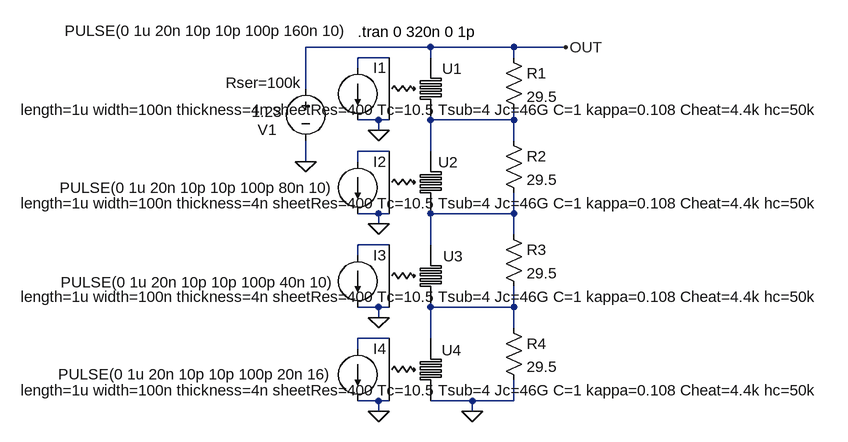
[diagram p0: schematic 4-element-pnr-test.asc]
4-element-pnr-test.asc, the LTspice schematic file:
Version 4
SHEET 1 880 680
WIRE 208 32 16 32
WIRE 336 32 208 32
WIRE 416 32 336 32
WIRE 144 48 96 48
WIRE 208 48 208 32
WIRE 336 48 336 32
WIRE 96 64 96 48
WIRE 16 96 16 32
WIRE 128 144 96 144
WIRE 144 144 128 144
WIRE 336 144 336 128
WIRE 336 144 208 144
WIRE 128 160 128 144
WIRE 336 176 336 144
WIRE 144 192 96 192
WIRE 208 192 208 144
WIRE 16 208 16 176
WIRE 96 208 96 192
WIRE 128 288 96 288
WIRE 144 288 128 288
WIRE 336 288 336 256
WIRE 336 288 208 288
WIRE 128 304 128 288
WIRE 336 320 336 288
WIRE 144 336 96 336
WIRE 208 336 208 288
WIRE 96 352 96 336
WIRE 128 432 96 432
WIRE 144 432 128 432
WIRE 336 432 336 400
WIRE 336 432 208 432
WIRE 128 448 128 432
WIRE 336 464 336 432
WIRE 144 480 96 480
WIRE 208 480 208 432
WIRE 96 496 96 480
WIRE 128 576 96 576
WIRE 144 576 128 576
WIRE 272 576 208 576
WIRE 336 576 336 544
WIRE 336 576 272 576
WIRE 128 592 128 576
WIRE 272 592 272 576
FLAG 128 160 0
FLAG 16 208 0
FLAG 128 304 0
FLAG 128 448 0
FLAG 128 592 0
FLAG 272 592 0
FLAG 416 32 OUT
SYMBOL snspdWithPhotonPort 208 96 R0
WINDOW 0 18 -31 Left 2
SYMATTR InstName U1
SYMATTR Value Lind=100n Isw=12.5u Tsub=1.18
SYMBOL res 320 32 R0
SYMATTR InstName R1
SYMATTR Value 29.5
SYMBOL current 96 64 R0
WINDOW 3 -451 -57 Left 2
WINDOW 123 0 0 Left 2
WINDOW 39 0 0 Left 2
SYMATTR Value PULSE(0 1u 20n 10p 10p 100p 160n 10)
SYMATTR InstName I1
SYMBOL snspdWithPhotonPort 208 240 R0
WINDOW 0 12 -31 Left 2
SYMATTR InstName U2
SYMATTR Value Lind=100n Isw=12.5u Tsub=1.18
SYMBOL res 320 160 R0
SYMATTR InstName R2
SYMATTR Value 29.5
SYMBOL current 96 208 R0
WINDOW 3 -459 40 Left 2
WINDOW 123 0 0 Left 2
WINDOW 39 0 0 Left 2
SYMATTR Value PULSE(0 1u 20n 10p 10p 100p 80n 10)
SYMATTR InstName I2
SYMBOL voltage 16 80 R0
WINDOW 0 -74 79 Left 2
WINDOW 3 -83 51 Left 2
WINDOW 123 0 0 Left 2
WINDOW 39 -123 7 Left 2
SYMATTR InstName V1
SYMATTR Value 1.23
SYMATTR SpiceLine Rser=100k
SYMBOL snspdWithPhotonPort 208 384 R0
WINDOW 0 19 -30 Left 2
SYMATTR InstName U3
SYMATTR Value Lind=100n Isw=12.5u Tsub=1.18
SYMBOL res 320 304 R0
SYMATTR InstName R3
SYMATTR Value 29.5
SYMBOL current 96 352 R0
WINDOW 3 -457 42 Left 2
WINDOW 123 0 0 Left 2
WINDOW 39 0 0 Left 2
SYMATTR Value PULSE(0 1u 20n 10p 10p 100p 40n 10)
SYMATTR InstName I3
SYMBOL snspdWithPhotonPort 208 528 R0
WINDOW 0 17 -30 Left 2
SYMATTR InstName U4
SYMATTR Value Lind=100n Isw=12.5u Tsub=1.18
SYMBOL res 320 448 R0
SYMATTR InstName R4
SYMATTR Value 29.5
SYMBOL current 96 496 R0
WINDOW 3 -461 39 Left 2
WINDOW 123 0 0 Left 2
WINDOW 39 0 0 Left 2
SYMATTR Value PULSE(0 1u 20n 10p 10p 100p 20n 16)
SYMATTR InstName I4
TEXT 96 8 Left 2 !.tran 0 320n 0 1p

The netlist it stands for:
* 4-element-pnr-test.asc
XU1 N001 0 OUT N002 nanowireDynamic Lind=100n Isw=12.5u Tsub=1.18 length=1u width=100n thickness=4n sheetRes=400 Tc=10.5 Tsub=4 Jc=46G C=1 kappa=0.108 Cheat=4.4k hc=50k  ; pins gate-in photon-out source drain
R1 OUT N002 29.5
I1 N001 0 PULSE(0 1u 20n 10p 10p 100p 160n 10)
XU2 N003 0 N002 N004 nanowireDynamic Lind=100n Isw=12.5u Tsub=1.18 length=1u width=100n thickness=4n sheetRes=400 Tc=10.5 Tsub=4 Jc=46G C=1 kappa=0.108 Cheat=4.4k hc=50k  ; pins gate-in photon-out source drain
R2 N002 N004 29.5
I2 N003 0 PULSE(0 1u 20n 10p 10p 100p 80n 10)
V1 OUT 0 1.23 Rser=100k
XU3 N005 0 N004 N006 nanowireDynamic Lind=100n Isw=12.5u Tsub=1.18 length=1u width=100n thickness=4n sheetRes=400 Tc=10.5 Tsub=4 Jc=46G C=1 kappa=0.108 Cheat=4.4k hc=50k  ; pins gate-in photon-out source drain
R3 N004 N006 29.5
I3 N005 0 PULSE(0 1u 20n 10p 10p 100p 40n 10)
XU4 N007 0 N006 0 nanowireDynamic Lind=100n Isw=12.5u Tsub=1.18 length=1u width=100n thickness=4n sheetRes=400 Tc=10.5 Tsub=4 Jc=46G C=1 kappa=0.108 Cheat=4.4k hc=50k  ; pins gate-in photon-out source drain
R4 N006 0 29.5
I4 N007 0 PULSE(0 1u 20n 10p 10p 100p 20n 16)
.tran 0 320n 0 1p
.lib snspd.lib
.backanno
.end